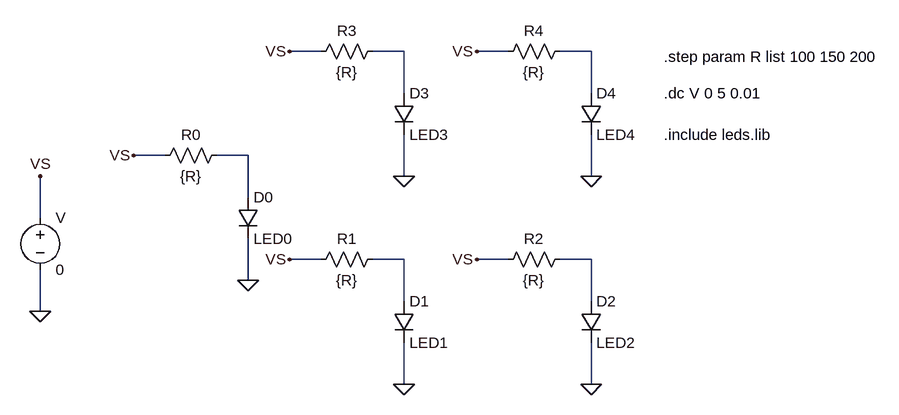
[diagram p0: schematic LED.asc]
LED.asc, the LTspice schematic file:
Version 4.1
SHEET 1 1400 680
WIRE -256 48 -304 48
WIRE -128 48 -176 48
WIRE 32 48 -16 48
WIRE 160 48 112 48
WIRE -128 112 -128 48
WIRE 160 112 160 48
WIRE -496 208 -544 208
WIRE -368 208 -416 208
WIRE -128 240 -128 176
WIRE 160 240 160 176
WIRE -368 272 -368 208
WIRE -688 304 -688 240
WIRE -256 368 -304 368
WIRE -128 368 -176 368
WIRE 32 368 -16 368
WIRE 160 368 112 368
WIRE -368 400 -368 336
WIRE -128 432 -128 368
WIRE 160 432 160 368
WIRE -688 448 -688 384
WIRE -128 560 -128 496
WIRE 160 560 160 496
FLAG -688 448 0
FLAG -688 240 VS
FLAG -304 48 VS
FLAG -544 208 VS
FLAG -16 48 VS
FLAG -16 368 VS
FLAG -304 368 VS
FLAG -128 240 0
FLAG 160 240 0
FLAG 160 560 0
FLAG -128 560 0
FLAG -368 400 0
SYMBOL res -160 352 R90
WINDOW 0 0 56 VBottom 2
WINDOW 3 32 56 VTop 2
SYMATTR InstName R1
SYMATTR Value {R}
SYMBOL voltage -688 288 R0
WINDOW 123 0 0 Left 0
WINDOW 39 0 0 Left 0
SYMATTR InstName V
SYMATTR Value 0
SYMBOL diode -144 432 R0
SYMATTR InstName D1
SYMATTR Value LED1
SYMBOL res 128 352 R90
WINDOW 0 0 56 VBottom 2
WINDOW 3 32 56 VTop 2
SYMATTR InstName R2
SYMATTR Value {R}
SYMBOL diode 144 432 R0
SYMATTR InstName D2
SYMATTR Value LED2
SYMBOL res -160 32 R90
WINDOW 0 0 56 VBottom 2
WINDOW 3 32 56 VTop 2
SYMATTR InstName R3
SYMATTR Value {R}
SYMBOL diode -144 112 R0
SYMATTR InstName D3
SYMATTR Value LED3
SYMBOL res 128 32 R90
WINDOW 0 0 56 VBottom 2
WINDOW 3 32 56 VTop 2
SYMATTR InstName R4
SYMATTR Value {R}
SYMBOL diode 144 112 R0
SYMATTR InstName D4
SYMATTR Value LED4
SYMBOL res -400 192 R90
WINDOW 0 0 56 VBottom 2
WINDOW 3 32 56 VTop 2
SYMATTR InstName R0
SYMATTR Value {R}
SYMBOL diode -384 272 R0
SYMATTR InstName D0
SYMATTR Value LED0
TEXT 272 176 Left 2 !.include leds.lib
TEXT 272 112 Left 2 !.dc V 0 5 0.01
TEXT 272 56 Left 2 !.step param R list 100 150 200

The netlist it stands for:
* LED.asc
R1 N004 VS {R}
V VS 0 0
D1 N004 0 LED1
R2 N005 VS {R}
D2 N005 0 LED2
R3 N001 VS {R}
D3 N001 0 LED3
R4 N002 VS {R}
D4 N002 0 LED4
R0 N003 VS {R}
D0 N003 0 LED0
.model D D
.lib standard.dio
.include leds.lib
.dc V 0 5 0.01
.step param R list 100 150 200
.backanno
.end